# Altium schematic sheet toplevel.SchDoc: Vacuum chamber sensorboard - Top level
size A4; SheetNumber: 1; SheetTotal: 6; PageSetup: Record=PageOptions|CenterHorizontal=True|CenterVertical=True|PrintScale=2.81|XCorrection=1.00|YCorrection=1.00|PrintKind=0|BorderSize=5000000|LeftOffset=0|BottomOffset=0|Orientation=2|PaperLength=1000|PaperWidth=1000|Scale=100|PaperSource=7|PrintQuality=-4|MediaType=1|DitherType=10|PaperKind=A1 (594 x 841mm)|PrintScaleMode=1
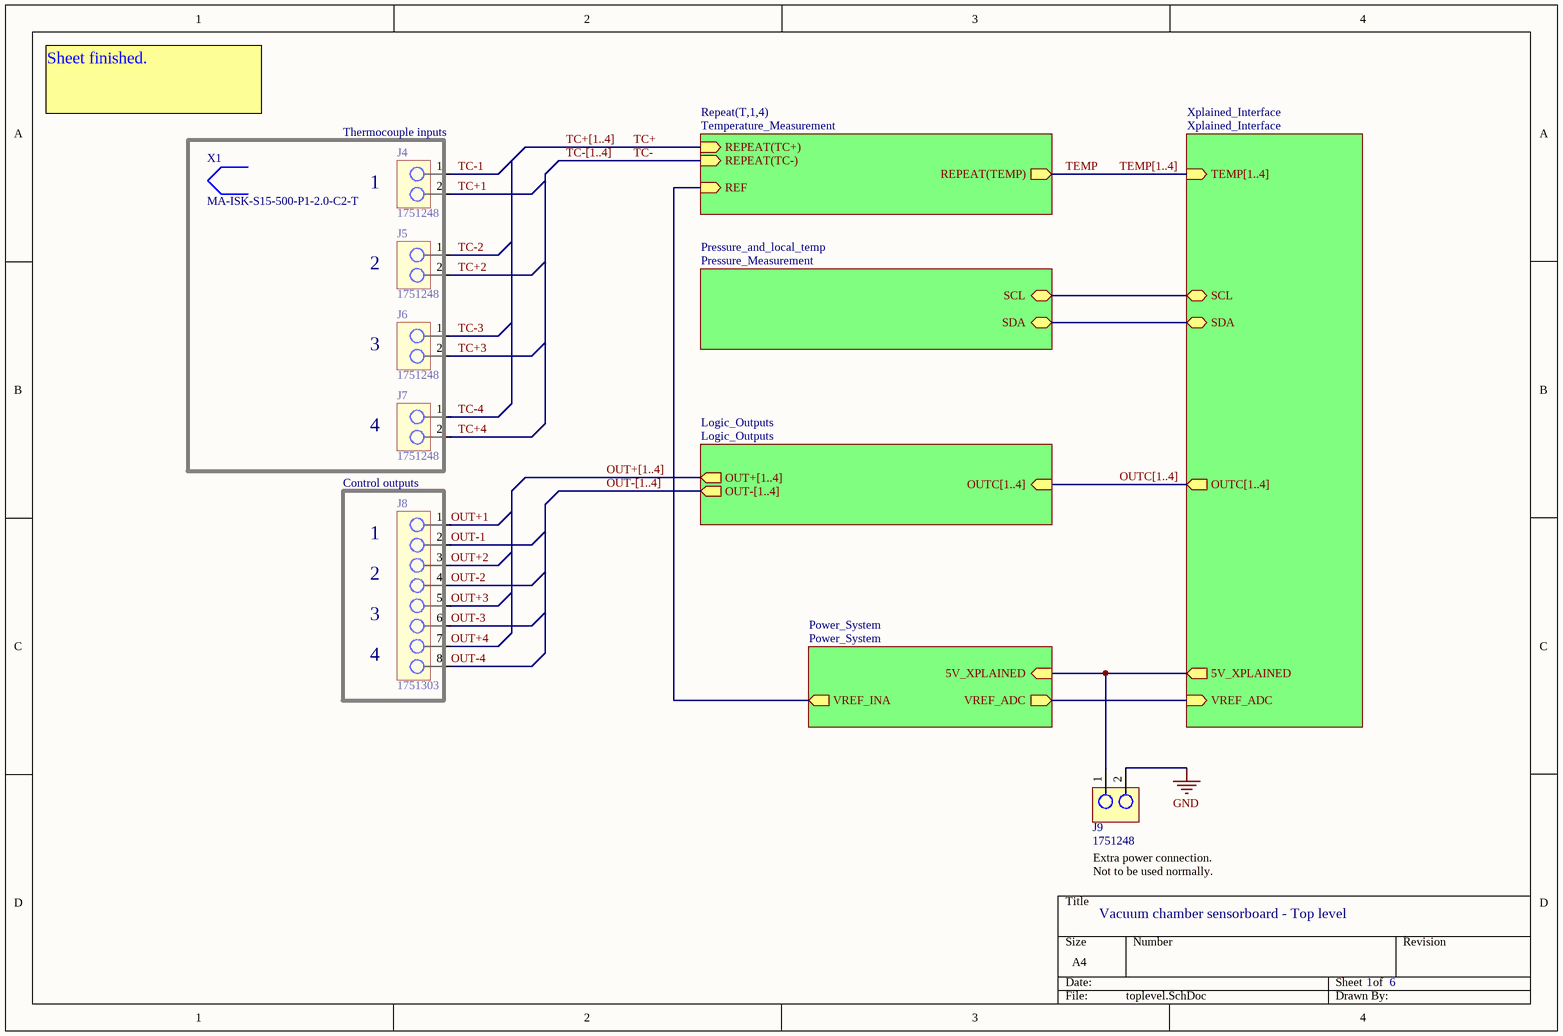
[diagram p0: toplevel.SchDoc]

## Parts
J4  1751248  [Terminalblock Pheonix 2P]
J5  1751248  [Terminalblock Pheonix 2P]
J6  1751248  [Terminalblock Pheonix 2P]
J7  1751248  [Terminalblock Pheonix 2P]
J8  1751303  [TERMINALBLOCK pheonix 8p]
J9  1751248  [Terminalblock Pheonix 2P]
X1  MA-ISK-S15-500-P1-2.0-C2-T  (mechanical)

## Sub-sheets
Logic_Outputs = Logic_Outputs: OUT+[1..4] (out), OUTC[1..4] (in), OUT-[1..4] (out)
Power_System = Power_System: 5V_XPLAINED (in), VREF_ADC (out), VREF_INA (out)
Pressure_and_local_temp = Pressure_Measurement: SDA (bidir), SCL (bidir)
Repeat(T,1,4) = Temperature_Measurement: REPEAT(TC-) (in), REPEAT(TC+) (in), REPEAT(TEMP) (out), REF (in)
Xplained_Interface = Xplained_Interface: OUTC[1..4] (out), VREF_ADC (in), 5V_XPLAINED (out), SCL (bidir), SDA (bidir), TEMP[1..4] (in)

## Nets
GND: J9.2
OUT+1: J8.1
OUT+2: J8.3
OUT+3: J8.5
OUT+4: J8.7
OUT-1: J8.2
OUT-2: J8.4
OUT-3: J8.6
OUT-4: J8.8
TC+: sheet Repeat(T,1,4)/REPEAT(TC+)
TC+1: J4.2
TC+2: J5.2
TC+3: J6.2
TC+4: J7.2
TC-: sheet Repeat(T,1,4)/REPEAT(TC-)
TC-1: J4.1
TC-2: J5.1
TC-3: J6.1
TC-4: J7.1
TEMP: sheet Repeat(T,1,4)/REPEAT(TEMP)
NetJ9_1: J9.1 ; sheet Xplained_Interface/5V_XPLAINED, sheet Power_System/5V_XPLAINED
(unnamed): sheet Xplained_Interface/VREF_ADC, sheet Power_System/VREF_ADC
(unnamed): sheet Xplained_Interface/SCL, sheet Pressure_and_local_temp/SCL
(unnamed): sheet Xplained_Interface/SDA, sheet Pressure_and_local_temp/SDA
(unnamed): sheet Repeat(T,1,4)/REF, sheet Power_System/VREF_INA

## Buses and harness runs
bus OUT+[1..4] = sheet Logic_Outputs/OUT+[1..4]
bus OUT-[1..4] = sheet Logic_Outputs/OUT-[1..4]
bus OUTC[1..4] = sheet Logic_Outputs/OUTC[1..4] = sheet Xplained_Interface/OUTC[1..4]
bus TC+[1..4]
bus TC-[1..4]
bus TEMP[1..4] = sheet Xplained_Interface/TEMP[1..4]

## Notes on the sheet
- Sheet finished.
- (near J4) Thermocouple inputs
- (near J4) 1
- (near J5) 2
- (near J6) 3
- (near J7) 4
- Control outputs
- (near J8) 1
- (near J8) 2
- (near J8) 3
- (near J8) 4
- Extra power connection.
  Not to be used normally.

## Library data of the parts
J4-J7 J9 = 1751248: Terminal block, 2P, 3.5mm, screw; Manufacturer: Phoenix Contact; ComponentLink1Description: Datasheet; ComponentLink1URL: https://www.phoenixcontact.com/online/portal/us?uri=pxc-oc-itemdetail:pid=1751248&library=usen&pcck=P-11-01-01&tab=1; PackageReference: SIP; Supplier 1: Mouser; Supplier Part Number 1: 651-1751248
J8 = 1751303: Terminal block, 8P, 3.5mm, screw; Manufacturer: Phoenix Contact; ComponentLink1Description: Datasheet; ComponentLink1URL: https://www.phoenixcontact.com/online/portal/us?uri=pxc-oc-itemdetail:pid=1751303&library=usen&pcck=P-11-01-01&tab=1; PackageReference: SIP; Supplier 1: Mouser; Supplier Part Number 1: 651-1751303
X1 = MA-ISK-S15-500-P1-2.0-C2-T: Type K thermocouple, mineral insulated; Manufacturer: Labfacility; PackageReference: http://www.farnell.com/datasheets/49105.pdf; ComponentLink1Description: Datasheet; ComponentLink1URL: http://www.ti.com/lit/ds/slvs720d/slvs720d.pdf; Supplier 1: Farnell; Supplier Part Number 1: 1289623